# Altium schematic sheet altium_custom_template.SchDoc
size A4
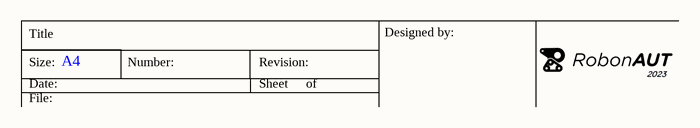
[diagram p0: altium_custom_template.SchDoc]

## Notes on the sheet
- Title
- Size:
- Date:
- A4
- Number:
- Revision:
- Sheet
- of
- Designed by:
- File: